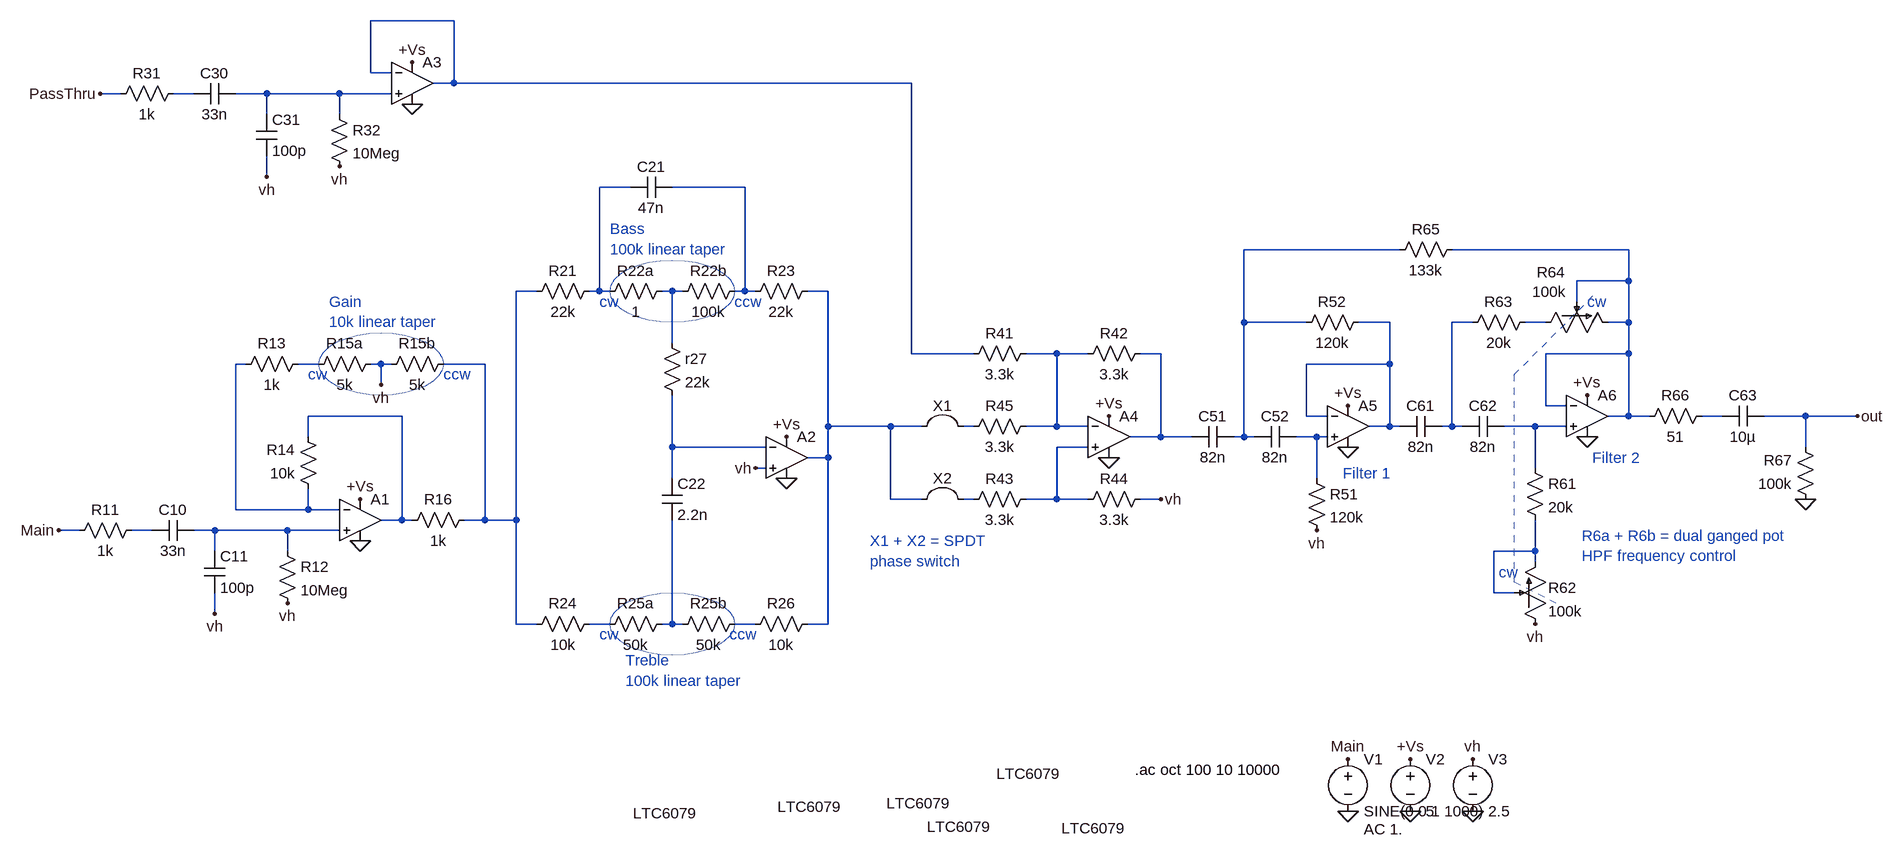
[diagram p0: schematic Channel Two model circuit.asc]
Channel Two model circuit.asc, the LTspice schematic file:
Version 4
SHEET 1 1044 1256
WIRE -1712 -512 -1840 -512
WIRE -1840 -432 -1840 -512
WIRE -1808 -432 -1840 -432
WIRE -1712 -416 -1712 -512
WIRE -1712 -416 -1744 -416
WIRE -1008 -416 -1712 -416
WIRE -2224 -400 -2256 -400
WIRE -2112 -400 -2144 -400
WIRE -2000 -400 -2048 -400
WIRE -1888 -400 -2000 -400
WIRE -1808 -400 -1888 -400
WIRE -2000 -368 -2000 -400
WIRE -1888 -368 -1888 -400
WIRE -2000 -272 -2000 -304
WIRE -1440 -256 -1488 -256
WIRE -1264 -256 -1376 -256
WIRE -256 -160 -496 -160
WIRE 96 -160 -176 -160
WIRE 96 -112 96 -160
WIRE 96 -112 16 -112
WIRE -1584 -96 -1616 -96
WIRE -1488 -96 -1488 -256
WIRE -1488 -96 -1504 -96
WIRE -1472 -96 -1488 -96
WIRE -1376 -96 -1392 -96
WIRE -1360 -96 -1376 -96
WIRE -1264 -96 -1264 -256
WIRE -1264 -96 -1280 -96
WIRE -1248 -96 -1264 -96
WIRE -1136 -96 -1168 -96
WIRE 16 -80 16 -112
WIRE -496 -48 -496 -160
WIRE -400 -48 -496 -48
WIRE -272 -48 -320 -48
WIRE -144 -48 -176 -48
WIRE -32 -48 -64 -48
WIRE 96 -48 96 -112
WIRE 96 -48 64 -48
WIRE -1376 -16 -1376 -96
WIRE -1008 0 -1008 -416
WIRE -912 0 -1008 0
WIRE -784 0 -832 0
WIRE -736 0 -784 0
WIRE -624 0 -656 0
WIRE 96 0 96 -48
WIRE 96 0 -32 0
WIRE -2032 16 -2048 16
WIRE -1920 16 -1952 16
WIRE -1824 16 -1840 16
WIRE -1808 16 -1824 16
WIRE -1664 16 -1728 16
WIRE -272 16 -272 -48
WIRE -272 16 -400 16
WIRE -1824 48 -1824 16
WIRE -32 80 -32 0
WIRE 0 80 -32 80
WIRE -1792 96 -1936 96
WIRE -400 96 -400 16
WIRE -368 96 -400 96
WIRE 96 96 96 0
WIRE 96 96 64 96
WIRE 128 96 96 96
WIRE 240 96 208 96
WIRE 368 96 304 96
WIRE 448 96 368 96
WIRE -1136 112 -1136 -96
WIRE -1040 112 -1136 112
WIRE -992 112 -1040 112
WIRE -912 112 -928 112
WIRE -784 112 -784 0
WIRE -784 112 -832 112
WIRE -736 112 -784 112
WIRE -272 112 -272 16
WIRE -272 112 -304 112
WIRE -256 112 -272 112
WIRE -176 112 -176 -48
WIRE -176 112 -192 112
WIRE -160 112 -176 112
WIRE -48 112 -96 112
WIRE 0 112 -48 112
WIRE -1936 128 -1936 96
WIRE -624 128 -624 0
WIRE -624 128 -672 128
WIRE -576 128 -624 128
WIRE -496 128 -496 -48
WIRE -496 128 -512 128
WIRE -480 128 -496 128
WIRE -384 128 -416 128
WIRE -368 128 -384 128
WIRE -1376 144 -1376 64
WIRE -1232 144 -1376 144
WIRE -736 144 -784 144
WIRE 368 144 368 96
WIRE -1136 160 -1136 112
WIRE -1136 160 -1168 160
WIRE -1232 176 -1248 176
WIRE -48 176 -48 112
WIRE -1376 192 -1376 144
WIRE -384 192 -384 128
WIRE -1040 224 -1040 112
WIRE -992 224 -1040 224
WIRE -912 224 -928 224
WIRE -784 224 -784 144
WIRE -784 224 -832 224
WIRE -736 224 -784 224
WIRE -624 224 -656 224
WIRE -2048 240 -2048 16
WIRE -1936 240 -1936 208
WIRE -1936 240 -2048 240
WIRE -1888 240 -1936 240
WIRE -1792 256 -1792 96
WIRE -1792 256 -1824 256
WIRE -1776 256 -1792 256
WIRE -1664 256 -1664 16
WIRE -1664 256 -1696 256
WIRE -1616 256 -1616 -96
WIRE -1616 256 -1664 256
WIRE -2288 272 -2320 272
WIRE -2176 272 -2208 272
WIRE -2080 272 -2112 272
WIRE -1968 272 -2080 272
WIRE -1888 272 -1968 272
WIRE -2080 304 -2080 272
WIRE -1968 304 -1968 272
WIRE -48 304 -48 256
WIRE -48 304 -112 304
WIRE -48 320 -48 304
WIRE -112 368 -112 304
WIRE -80 368 -112 368
WIRE -2080 400 -2080 368
WIRE -1616 416 -1616 256
WIRE -1584 416 -1616 416
WIRE -1472 416 -1504 416
WIRE -1376 416 -1376 256
WIRE -1376 416 -1392 416
WIRE -1360 416 -1376 416
WIRE -1248 416 -1280 416
WIRE -1136 416 -1136 160
WIRE -1136 416 -1168 416
FLAG -240 704 0
FLAG -336 704 0
FLAG -336 624 Main
FLAG -240 624 +Vs
FLAG -704 160 0
FLAG -704 96 +Vs
FLAG -1776 -384 0
FLAG -1776 -448 +Vs
FLAG -336 144 0
FLAG -336 80 +Vs
FLAG 32 128 0
FLAG 32 64 +Vs
FLAG -1888 -288 vh
FLAG -384 272 vh
FLAG -48 416 vh
FLAG 368 224 0
FLAG -2000 -272 vh
FLAG -624 224 vh
FLAG -1200 192 0
FLAG -1200 128 +Vs
FLAG -1248 176 vh
FLAG -1856 288 0
FLAG -1856 224 +Vs
FLAG -1968 384 vh
FLAG -2080 400 vh
FLAG -1824 48 vh
FLAG -144 704 0
FLAG -144 624 vh
FLAG -2320 272 Main
FLAG -2256 -400 PassThru
FLAG 448 96 out
SYMBOL cap -192 96 R90
WINDOW 0 0 32 VBottom 2
WINDOW 3 32 32 VTop 2
SYMATTR InstName C61
SYMATTR Value 82n
SYMBOL cap -96 96 R90
WINDOW 0 0 32 VBottom 2
WINDOW 3 32 32 VTop 2
SYMATTR InstName C62
SYMATTR Value 82n
SYMBOL res -48 -64 R90
WINDOW 0 0 56 VBottom 2
WINDOW 3 32 56 VTop 2
SYMATTR InstName R63
SYMATTR Value 20k
SYMBOL res -64 160 R0
SYMATTR InstName R61
SYMATTR Value 20k
SYMBOL res -1904 -384 R0
SYMATTR InstName R32
SYMATTR Value 10Meg
SYMBOL res -2128 -416 R90
WINDOW 0 0 56 VBottom 2
WINDOW 3 32 56 VTop 2
SYMATTR InstName R31
SYMATTR Value 1k
SYMBOL POT 64 -64 R90
WINDOW 0 -61 65 VRight 2
WINDOW 3 -31 64 VRight 2
SYMATTR InstName R64
SYMATTR Value 100k
SYMBOL POT -64 320 R0
WINDOW 0 36 40 Left 2
WINDOW 3 36 76 Left 2
SYMATTR InstName R62
SYMATTR Value 100k
SYMBOL cap -2016 -368 R0
SYMATTR InstName C31
SYMATTR Value 100p
SYMBOL cap -512 112 R90
WINDOW 0 0 32 VBottom 2
WINDOW 3 32 32 VTop 2
SYMATTR InstName C51
SYMATTR Value 82n
SYMBOL cap -416 112 R90
WINDOW 0 0 32 VBottom 2
WINDOW 3 32 32 VTop 2
SYMATTR InstName C52
SYMATTR Value 82n
SYMBOL res -304 -64 R90
WINDOW 0 0 56 VBottom 2
WINDOW 3 32 56 VTop 2
SYMATTR InstName R52
SYMATTR Value 120k
SYMBOL res -400 176 R0
SYMATTR InstName R51
SYMATTR Value 120k
SYMBOL res -160 -176 R90
WINDOW 0 0 56 VBottom 2
WINDOW 3 32 56 VTop 2
SYMATTR InstName R65
SYMATTR Value 133k
SYMBOL voltage -336 608 R0
WINDOW 123 24 124 Left 2
WINDOW 39 0 0 Left 2
SYMATTR Value2 AC 1.
SYMATTR InstName V1
SYMATTR Value SINE(0 0.1 1000)
SYMBOL voltage -240 608 R0
WINDOW 123 0 0 Left 2
WINDOW 39 0 0 Left 2
SYMATTR InstName V2
SYMATTR Value 5
SYMBOL Opamps\\LTC6079 -704 128 R0
WINDOW 3 -73 602 Left 2
SYMATTR InstName A4
SYMBOL Opamps\\LTC6079 -1776 -416 R0
WINDOW 3 340 1123 Left 2
SYMATTR InstName A3
SYMBOL Opamps\\LTC6079 -336 112 R0
WINDOW 3 -648 616 Left 2
SYMATTR InstName A5
SYMBOL Opamps\\LTC6079 32 96 R0
WINDOW 3 -909 550 Left 2
SYMATTR InstName A6
SYMBOL cap 304 80 R90
WINDOW 0 0 32 VBottom 2
WINDOW 3 32 32 VTop 2
SYMATTR InstName C63
SYMATTR Value 10µ
SYMBOL res 224 80 R90
WINDOW 0 0 56 VBottom 2
WINDOW 3 32 56 VTop 2
SYMATTR InstName R66
SYMATTR Value 51
SYMBOL res 384 240 R180
WINDOW 0 36 76 Left 2
WINDOW 3 36 40 Left 2
SYMATTR InstName R67
SYMATTR Value 100k
SYMBOL res -640 -16 R90
WINDOW 0 0 56 VBottom 2
WINDOW 3 32 56 VTop 2
SYMATTR InstName R42
SYMATTR Value 3.3k
SYMBOL res -816 -16 R90
WINDOW 0 0 56 VBottom 2
WINDOW 3 32 56 VTop 2
SYMATTR InstName R41
SYMATTR Value 3.3k
SYMBOL res -816 208 R90
WINDOW 0 0 56 VBottom 2
WINDOW 3 32 56 VTop 2
SYMATTR InstName R43
SYMATTR Value 3.3k
SYMBOL res -640 208 R90
WINDOW 0 0 56 VBottom 2
WINDOW 3 32 56 VTop 2
SYMATTR InstName R44
SYMATTR Value 3.3k
SYMBOL Opamps\\LTC6079 -1200 160 R0
WINDOW 3 -14 537 Left 2
SYMATTR InstName A2
SYMBOL res -1488 -112 R90
WINDOW 0 0 56 VBottom 2
WINDOW 3 32 56 VTop 2
SYMATTR InstName R21
SYMATTR Value 22k
SYMBOL res -1376 -112 R90
WINDOW 0 0 56 VBottom 2
WINDOW 3 32 56 VTop 2
SYMATTR InstName R22a
SYMATTR Value 1
SYMBOL res -1264 -112 R90
WINDOW 0 0 56 VBottom 2
WINDOW 3 32 56 VTop 2
SYMATTR InstName R22b
SYMATTR Value 100k
SYMBOL res -1152 -112 R90
WINDOW 0 0 56 VBottom 2
WINDOW 3 32 56 VTop 2
SYMATTR InstName R23
SYMATTR Value 22k
SYMBOL res -1488 400 R90
WINDOW 0 0 56 VBottom 2
WINDOW 3 32 56 VTop 2
SYMATTR InstName R24
SYMATTR Value 10k
SYMBOL res -1376 400 R90
WINDOW 0 0 56 VBottom 2
WINDOW 3 32 56 VTop 2
SYMATTR InstName R25a
SYMATTR Value 50k
SYMBOL res -1264 400 R90
WINDOW 0 0 56 VBottom 2
WINDOW 3 32 56 VTop 2
SYMATTR InstName R25b
SYMATTR Value 50k
SYMBOL res -1152 400 R90
WINDOW 0 0 56 VBottom 2
WINDOW 3 32 56 VTop 2
SYMATTR InstName R26
SYMATTR Value 10k
SYMBOL res -1392 -32 R0
SYMATTR InstName r27
SYMATTR Value 22k
SYMBOL cap -1392 192 R0
SYMATTR InstName C22
SYMATTR Value 2.2n
SYMBOL cap -1376 -272 R90
WINDOW 0 0 32 VBottom 2
WINDOW 3 32 32 VTop 2
SYMATTR InstName C21
SYMATTR Value 47n
SYMBOL res -1984 288 R0
SYMATTR InstName R12
SYMATTR Value 10Meg
SYMBOL res -2192 256 R90
WINDOW 0 0 56 VBottom 2
WINDOW 3 32 56 VTop 2
SYMATTR InstName R11
SYMATTR Value 1k
SYMBOL cap -2096 304 R0
SYMATTR InstName C11
SYMATTR Value 100p
SYMBOL Opamps\\LTC6079 -1856 256 R0
WINDOW 3 810 436 Left 2
SYMATTR InstName A1
SYMBOL res -1680 240 R90
WINDOW 0 0 56 VBottom 2
WINDOW 3 32 56 VTop 2
SYMATTR InstName R16
SYMATTR Value 1k
SYMBOL res -1712 0 R90
WINDOW 0 0 56 VBottom 2
WINDOW 3 32 56 VTop 2
SYMATTR InstName R15b
SYMATTR Value 5k
SYMBOL res -1824 0 R90
WINDOW 0 0 56 VBottom 2
WINDOW 3 32 56 VTop 2
SYMATTR InstName R15a
SYMATTR Value 5k
SYMBOL res -1936 0 R90
WINDOW 0 0 56 VBottom 2
WINDOW 3 32 56 VTop 2
SYMATTR InstName R13
SYMATTR Value 1k
SYMBOL res -1920 224 R180
WINDOW 0 36 76 Left 2
WINDOW 3 36 40 Left 2
SYMATTR InstName R14
SYMATTR Value 10k
SYMBOL voltage -144 608 R0
WINDOW 123 0 0 Left 0
WINDOW 39 0 0 Left 0
SYMATTR InstName V3
SYMATTR Value 2.5
SYMBOL cap -2112 256 R90
WINDOW 0 0 32 VBottom 2
WINDOW 3 32 32 VTop 2
SYMATTR InstName C10
SYMATTR Value 33n
SYMBOL cap -2048 -416 R90
WINDOW 0 0 32 VBottom 2
WINDOW 3 32 32 VTop 2
SYMATTR InstName C30
SYMATTR Value 33n
SYMBOL res -816 96 R90
WINDOW 0 0 56 VBottom 2
WINDOW 3 32 56 VTop 2
SYMATTR InstName R45
SYMATTR Value 3.3k
SYMBOL Misc\\jumper -960 48 R0
SYMATTR InstName X1
SYMBOL Misc\\jumper -960 160 R0
SYMATTR InstName X2
TEXT -664 640 Left 2 !.ac oct 100 10 10000
TEXT 32 -80 Left 2 ;cw
TEXT -104 336 Left 2 ;cw
TEXT 24 280 Left 2 ;R6a + R6b = dual ganged pot\nHPF frequency control
TEXT -344 184 Left 2 ;Filter 1
TEXT 40 160 Left 2 ;Filter 2
TEXT -1904 -80 Left 2 ;Gain\n10k linear taper
TEXT -1472 -192 Left 2 ;Bass\n100k linear taper
TEXT -1448 472 Left 2 ;Treble\n100k linear taper
TEXT -1936 32 Left 2 ;cw
TEXT -1728 32 Left 2 ;ccw
TEXT -1488 -80 Left 2 ;cw
TEXT -1488 432 Left 2 ;cw
TEXT -1280 -80 Left 2 ;ccw
TEXT -1288 432 Left 2 ;ccw
TEXT -1072 288 Left 2 ;X1 + X2 = SPDT\nphase switch
LINE Normal -80 32 48 -96 2
LINE Normal -80 352 -80 32 2
LINE Normal -16 384 -80 352 2
CIRCLE Normal -1728 64 -1920 -32 2
CIRCLE Normal -1280 -48 -1472 -144 2
CIRCLE Normal -1280 464 -1472 368 2

The netlist it stands for:
* Channel Two model circuit.asc
C61 N012 N011 82n
C62 N020 N012 82n
R63 N013 N012 20k
R61 N020 N026 20k
R32 N003 vh 10Meg
R31 N002 PassThru 1k
R64 N007 N013 N007 100k
R62 N026 vh N026 100k
C31 N003 vh 100p
C51 N006 N015 82n
C52 N021 N006 82n
R52 N011 N006 120k
R51 N021 vh 120k
R65 N007 N006 133k
V1 Main 0 SINE(0 0.1 1000) AC 1.
V2 +Vs 0 5
XA4 N023 N014 +Vs 0 N015 LTC6078  ; LTC6079, pins In+ In- V+ V- OUT
XA3 N003 N001 +Vs 0 N001 LTC6078  ; LTC6079, pins In+ In- V+ V- OUT
XA5 N021 N011 +Vs 0 N011 LTC6078  ; LTC6079, pins In+ In- V+ V- OUT
XA6 N020 N007 +Vs 0 N007 LTC6078  ; LTC6079, pins In+ In- V+ V- OUT
C63 out N019 10µ
R66 N019 N007 51
R67 0 out 100k
R42 N015 N014 3.3k
R41 N014 N001 3.3k
R43 N023 N010 3.3k
R44 vh N023 3.3k
XA2 vh N022 +Vs 0 N010 LTC6078  ; LTC6079, pins In+ In- V+ V- OUT
R21 N004 N008 22k
R22a N009 N004 1
R22b N005 N009 100k
R23 N010 N005 22k
R24 N027 N008 10k
R25a N028 N027 50k
R25b N029 N028 50k
R26 N010 N029 10k
r27 N009 N022 22k
C22 N022 N028 2.2n
C21 N005 N004 47n
R12 N025 vh 10Meg
R11 N024 Main 1k
C11 N025 vh 100p
XA1 N025 N016 +Vs 0 N018 LTC6078  ; LTC6079, pins In+ In- V+ V- OUT
R16 N008 N018 1k
R15b N008 vh 5k
R15a vh N017 5k
R13 N017 N016 1k
R14 N016 N018 10k
V3 vh 0 2.5
C10 N025 N024 33n
C30 N003 N002 33n
R45 N014 N010 3.3k
.ac oct 100 10 10000
* cw
* cw
* R6a + R6b = dual ganged pot
* HPF frequency control
* Filter 1
* Filter 2
* Gain
* 10k linear taper
* Bass
* 100k linear taper
* Treble
* 100k linear taper
* cw
* ccw
* cw
* cw
* ccw
* ccw
* X1 + X2 = SPDT
* phase switch
.lib LTC5.lib
.backanno
.end